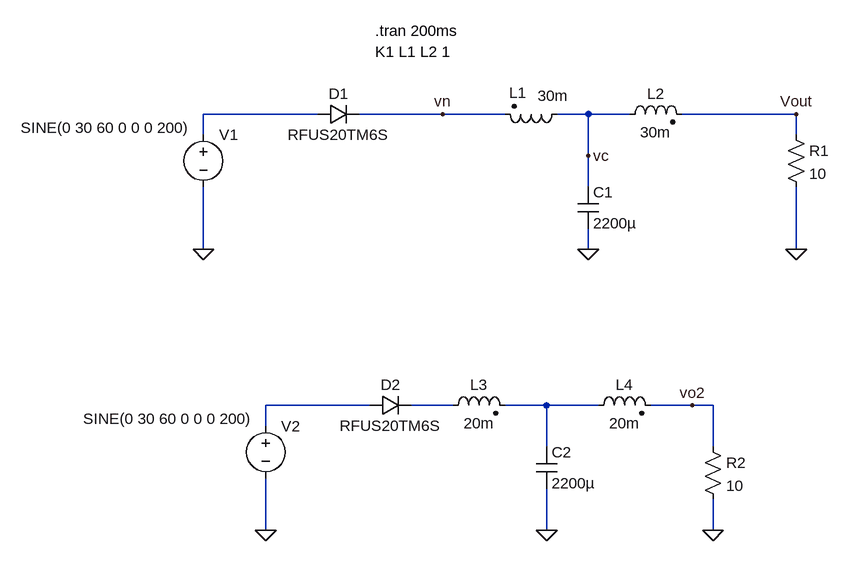
[diagram p0: schematic Draft4.asc]
Draft4.asc, the LTspice schematic file:
Version 4
SHEET 1 880 772
WIRE -176 112 -352 112
WIRE 16 112 -112 112
WIRE 112 112 16 112
WIRE 240 112 192 112
WIRE 304 112 240 112
WIRE 560 112 384 112
WIRE -352 144 -352 112
WIRE 560 144 560 112
WIRE 240 176 240 112
WIRE 240 224 240 176
WIRE -352 320 -352 224
WIRE 240 320 240 288
WIRE 560 320 560 224
WIRE -96 560 -256 560
WIRE 32 560 -32 560
WIRE 176 560 112 560
WIRE 256 560 176 560
WIRE 400 560 336 560
WIRE 432 560 400 560
WIRE -256 592 -256 560
WIRE 176 624 176 560
WIRE 432 624 432 560
WIRE -256 752 -256 672
WIRE 176 752 176 688
WIRE 432 752 432 704
FLAG 240 320 0
FLAG 560 320 0
FLAG -352 320 0
FLAG 560 112 Vout
FLAG 16 112 vn
FLAG 240 176 vc
FLAG 176 752 0
FLAG -256 752 0
FLAG 432 752 0
FLAG 400 560 vo2
SYMBOL ind2 208 96 R90
WINDOW 0 -1 76 VBottom 2
WINDOW 3 -28 22 VTop 2
SYMATTR InstName L1
SYMATTR Value 30m
SYMATTR Type ind
SYMATTR SpiceLine Rser=10m Rpar=1Meg Cpar=12p
SYMBOL ind2 288 128 R270
WINDOW 0 32 56 VTop 2
WINDOW 3 4 56 VBottom 2
SYMATTR InstName L2
SYMATTR Value 30m
SYMATTR Type ind
SYMATTR SpiceLine Rser=10m Rpar=1Meg Cpar=12p
SYMBOL cap 224 224 R0
SYMATTR InstName C1
SYMATTR Value 2200µ
SYMATTR SpiceLine Rser=10m Lser=10p Rpar=2Meg
SYMBOL res 544 128 R0
SYMATTR InstName R1
SYMATTR Value 10
SYMBOL voltage -352 128 R0
WINDOW 3 -281 5 Left 2
WINDOW 123 0 0 Left 0
WINDOW 39 0 0 Left 0
SYMATTR InstName V1
SYMATTR Value SINE(0 30 60 0 0 0 200)
SYMBOL diode -176 128 R270
WINDOW 0 32 32 VTop 2
WINDOW 3 0 32 VBottom 2
SYMATTR InstName D1
SYMATTR Value RFUS20TM6S
SYMBOL diode -96 576 R270
WINDOW 0 32 32 VTop 2
WINDOW 3 0 32 VBottom 2
SYMATTR InstName D2
SYMATTR Value RFUS20TM6S
SYMBOL voltage -256 576 R0
WINDOW 3 -281 5 Left 2
WINDOW 123 0 0 Left 0
WINDOW 39 0 0 Left 0
SYMATTR InstName V2
SYMATTR Value SINE(0 30 60 0 0 0 200)
SYMBOL res 416 608 R0
SYMATTR InstName R2
SYMATTR Value 10
SYMBOL ind2 16 576 R270
WINDOW 0 32 56 VTop 2
WINDOW 3 4 56 VBottom 2
SYMATTR InstName L3
SYMATTR Value 20m
SYMATTR Type ind
SYMATTR SpiceLine Rser=.1 Rpar=1Meg Cpar=12p
SYMBOL ind2 240 576 R270
WINDOW 0 32 56 VTop 2
WINDOW 3 4 56 VBottom 2
SYMATTR InstName L4
SYMATTR Value 20m
SYMATTR Type ind
SYMATTR SpiceLine Rser=.1 Rpar=1Meg Cpar=12p
SYMBOL cap 160 624 R0
SYMATTR InstName C2
SYMATTR Value 2200µ
SYMATTR SpiceLine Rser=10m Lser=10p Rpar=2Meg
TEXT -88 16 Left 2 !K1 L1 L2 1
TEXT -88 -16 Left 2 !.tran 200ms

The netlist it stands for:
* Draft4.asc
L1 vc vn 30m Rser=10m Rpar=1Meg Cpar=12p
L2 vc Vout 30m Rser=10m Rpar=1Meg Cpar=12p
C1 vc 0 2200µ Rser=10m Lser=10p Rpar=2Meg
R1 Vout 0 10
V1 N001 0 SINE(0 30 60 0 0 0 200)
D1 N001 vn RFUS20TM6S
D2 N002 N003 RFUS20TM6S
V2 N002 0 SINE(0 30 60 0 0 0 200)
R2 vo2 0 10
L3 N003 N004 20m Rser=.1 Rpar=1Meg Cpar=12p
L4 N004 vo2 20m Rser=.1 Rpar=1Meg Cpar=12p
C2 N004 0 2200µ Rser=10m Lser=10p Rpar=2Meg
.model D D
.lib standard.dio
K1 L1 L2 1
.tran 200ms
.backanno
.end